# EAGLE design bilancia_smart_pezzi_ali (EAGLE 7.3.0)
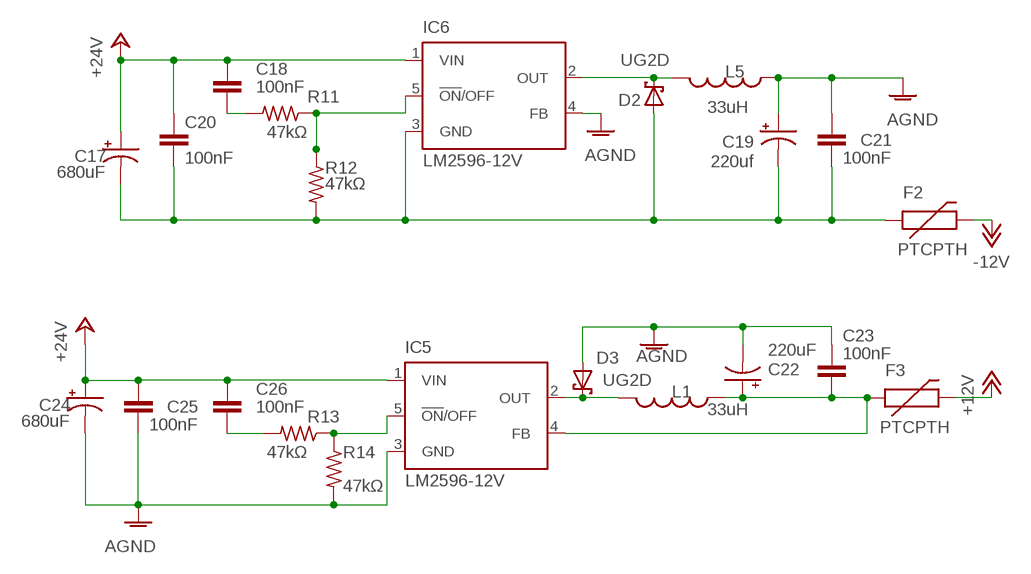
[diagram p0: schematic, sheet 1]

## Parts
C17  680uF  CPOL-USE5-8.5  [E5-8,5]
C18  100nF  C2.5/2  [C2.5-2]
C19  220uf  CPOL-USE5-8.5  [E5-8,5]
C20  100nF  C2.5/2  [C2.5-2]
C21  100nF  C2.5/2  [C2.5-2]
C22  220uF  CPOL-USE5-8.5  [E5-8,5]
C23  100nF  C2.5/2  [C2.5-2]
C24  680uF  CPOL-USE5-8.5  [E5-8,5]
C25  100nF  C2.5/2  [C2.5-2]
C26  100nF  C2.5/2  [C2.5-2]
D2  UG2D  SCHOTTKY-DIODEDO41-7  [DO41-7]
D3  UG2D  SCHOTTKY-DIODEDO41-7  [DO41-7]
F2  PTCPTH  [PTC]
F3  PTCPTH  [PTC]
IC5  LM2596-12V  LM2596T  [T05D]
IC6  LM2596-12V  LM2596T  [T05D]
L1  33uH  INDUCTORRLB0912  [RLB0912]
L5  33uH  INDUCTORRLB0912  [RLB0912]
R11  47kΩ  R-US_0207/2V  [0207/2V]
R12  47kΩ  R-US_0207/2V  [0207/2V]
R13  47kΩ  R-US_0207/2V  [0207/2V]
R14  47kΩ  R-US_0207/2V  [0207/2V]

## Nets
+12V [massa]: F3.P$2
+24V [massa]: C17.+ C18.1 C20.1 C24.+ C25.1 C26.1 IC5.1(VIN) IC6.1(VIN)
-12V [massa]: F2.P$2
AGND [massa]: C19.+ C21.1 C22.- C23.2 C24.- C25.2 D3.A IC5.3(GND) IC6.4(FB) L5.1 R14.2
N$14: IC6.5(!ON!/OFF) R11.1 R12.1
N$18: C18.2 R11.2
N$20 [massa]: D2.C IC6.2(OUT) L5.2
N$21 [massa]: C22.+ C23.1 F3.P$1 IC5.4(FB) L1.1
N$22 [massa]: C17.- C19.- C20.2 C21.2 D2.A F2.P$1 IC6.3(GND) R12.2
N$23 [massa]: D3.C IC5.2(OUT) L1.2
N$24: IC5.5(!ON!/OFF) R13.1 R14.1
N$25: C26.2 R13.2

## Library data of the parts
C17 C19 C22 C24 = resistor:CPOL-US: POLARIZED CAPACITOR, American symbol
C18 C20 C21 C23 C25 C26 = capacitor-wima:C: CAPACITOR naming: grid - package width
D2 D3 = adafruit:SCHOTTKY-DIODE: Schottky Diode
F2 F3 = SparkFun-PowerIC:PTC: Resettable Fuse PTC Resettable Fuse. Spark Fun Electronics SKU : COM-08357
IC5 IC6 = national-semiconductor:LM2596: SIMPLE SWITCHER® Power Converter 150 kHz 3A Step-Down Voltage Regulator Source: http://www.national.com/ds/LM/LM2596.pdf; MPN: LM2596T-ADJ/LF02; OC_FARNELL: 9494162; OC_NEWARK: 65K5910
L1 L5 = SparkFun-Passives:INDUCTOR: Inductors Basic Inductor/Choke - 0603 and 1206. Footprints are not proven and vary greatly between part numbers. SRN6045- 33uH, 20% 1.4A
R11-R14 = resistor:R-US_: RESISTOR, American symbol

## Net classes
0 default: clearance 0.205 mm
1 massa: width 0.5 mm, clearance 0.205 mm

## Board
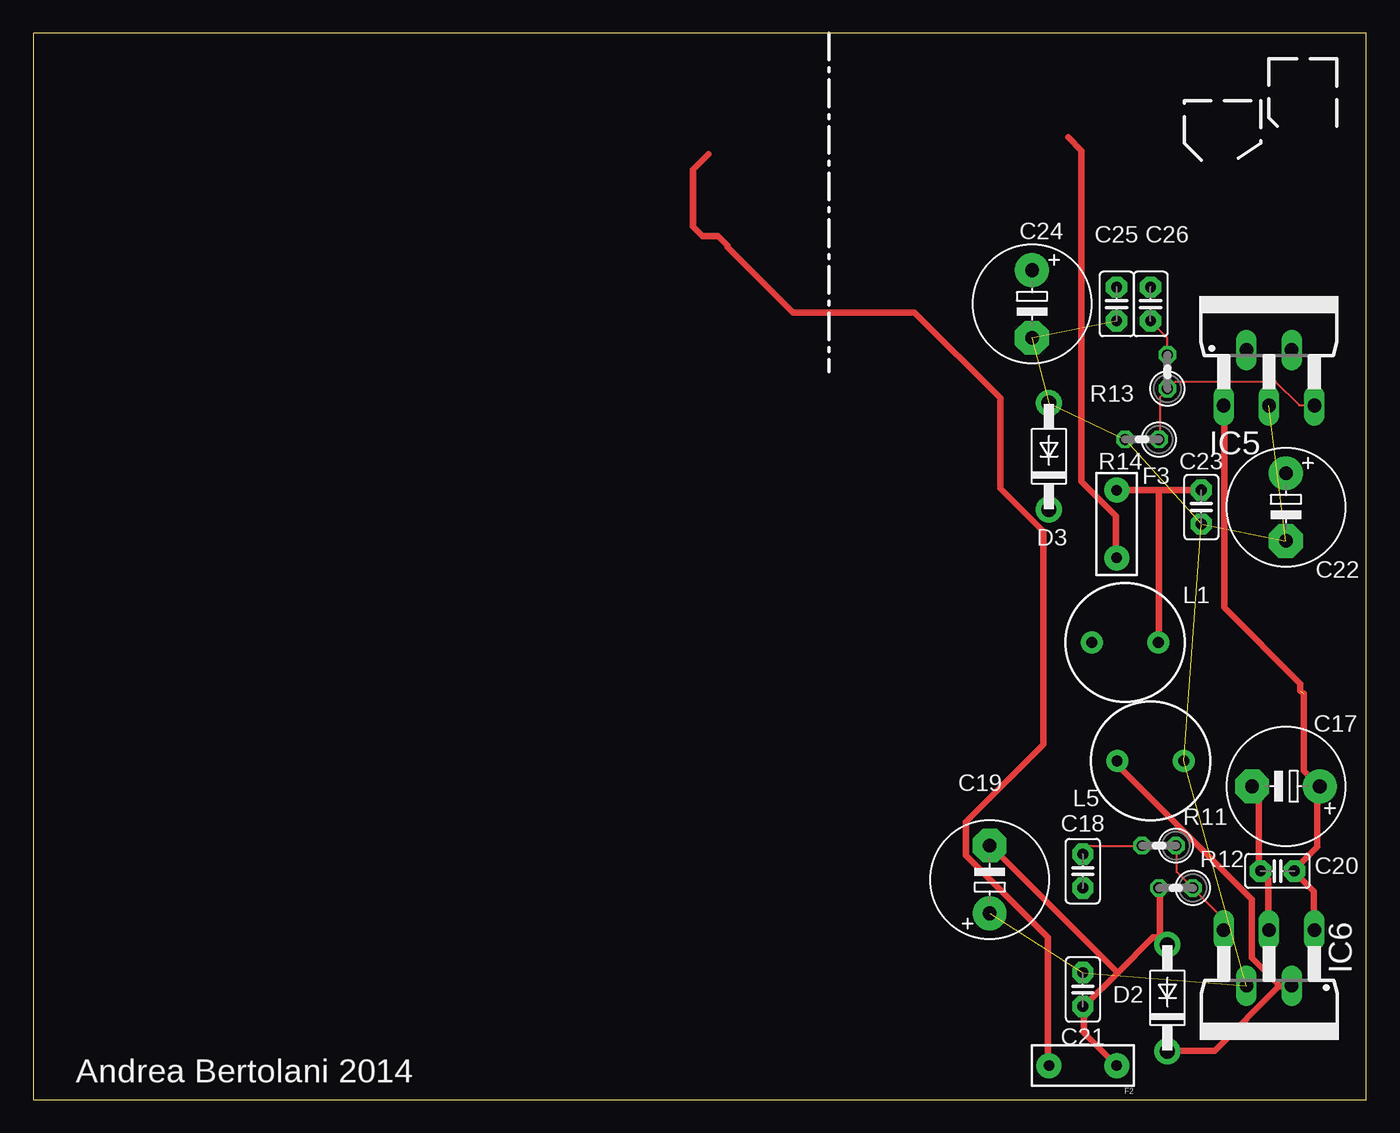
[diagram p1: board, top side]
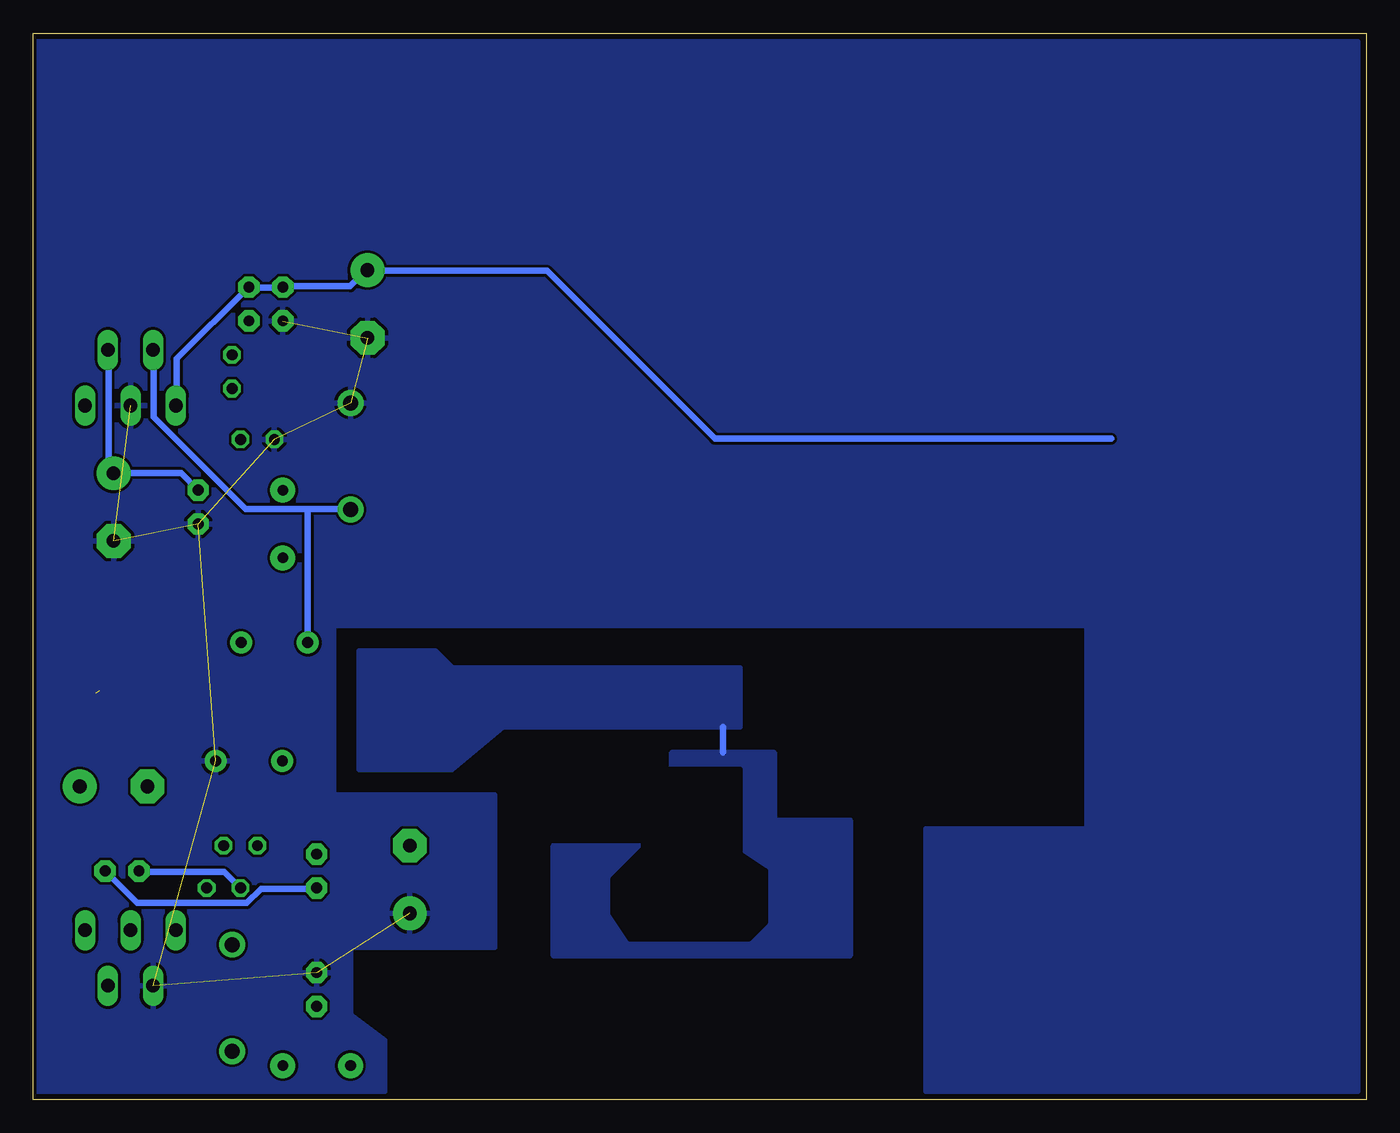
[diagram p2: board, bottom side, seen from below]

Size 100 x 80 mm. Coordinates in mm from the lower left corner, seen from the top.
Outline: 0,0 100,0 100,80 0,80 0,0
Copper layers (1*16): Top 0.035mm / dielectric 1.5mm / Bottom 0.035mm
Design rules "SeeedStudio_2layer_DRU_no_angle_20140221": minimum track width 6mil, minimum drill 12mil, track to track 6mil, track to pad 6mil, pad to pad 6mil, via to via 6mil, smd to smd 0mil, copper to edge 10mil, drill to drill 10mil, minimum pad ring 10mil, minimum via ring 6mil, stop-mask expansion 2mil, vias tented up to drill 100mil, thermal gap 10mil
tRestrict: area 45.1,12.1 to 56.5,24.8
bRestrict: area 45.1,12.1 to 56.5,24.8

### Footprints (pad centres in the part's own frame; a part is rotated, then mirrored left to right if it is on the bottom)
E5-8,5 = drill 1.016 pad 2.54: + -2.54,0 | drill 1.016 pad 2.54 octagon: - 2.54,0
C2.5-2 = drill 0.813 pad 1.6 octagon: 1 -1.27,0; 2 1.27,0
DO41-7 = drill 1.118 pad 1.93: A 4,0; C -4,0
PTC = drill 0.8 pad 1.88: P$1 -2.54,0; P$2 2.54,0
T05D = drill 1.016 long: 1 -3.404,-5.08; 2 -1.702,-0.914; 3 0,-5.08; 4 1.702,-0.914; 5 3.404,-5.08
RLB0912 = drill 0.813 pad 1.651: 1 2.502,0; 2 -2.502,0
0207/2V = drill 0.813 octagon: 1 -1.27,0; 2 1.27,0

### Placement (x,y rotation side)
C17  93.98,23.5 180 top
C18  78.74,17.14 90 top
C19  71.75,16.51 90 top
C20  93.34,17.14 180 top
C21  78.74,8.26 270 top
C22  93.98,44.45 270 top
C23  87.63,44.45 270 top
C24  74.93,59.69 270 top
C25  81.28,59.69 270 top
C26  83.82,59.69 270 top
D2  85.09,7.62 90 top
D3  76.2,48.26 90 top
F2  78.74,2.54 180 top
F3  81.28,43.18 270 top
IC5  92.71,57.15 0 top
IC6  92.71,7.62 180 top
L1  81.92,34.29 0 top
L5  83.82,25.4 0 top
R11  84.45,19.05 180 top
R12  85.72,15.88 180 top
R13  85.09,54.61 90 top
R14  83.19,49.53 180 top

### Tracks (layer width: path | path; a pad name or v marks a point on that pad's centre or on a via)
+12V
  Top 0.5: 77.64,72.19 78.63,71.21 78.63,46.37 81.22,43.78 81.22,40.65 F3.P$2
+24V  (1 unrouted)
  Top 0.5: 95.34,30.47 95.34,24.66 96.5,23.5 C17.+ 96.32,23.32 96.32,18.94 94.71,17.33 C20.1 94.62,17.07 96.05,15.64 96.05,12.78 IC6.1 | 95.07,30.65 95.07,31.18 89.35,36.9 89.35,52 IC5.1
  Bottom 0.5: C18.1 78.81,15.81 82.92,15.81 83.99,14.74 92.21,14.74 94.53,17.07 C20.1 | IC5.1 89.26,52.09 89.26,55.58 83.9,60.94 C26.1 83.63,60.94 81.31,60.94 C25.1 81.04,61.03 76.22,61.03 75.14,62.1 C24.+ 74.88,62.19 61.47,62.19 48.87,49.59 19.12,49.59
-12V
  Top 0.5: 50.66,70.94 49.5,69.78 49.5,65.49 50.22,64.78 51.38,64.78 52.09,64.06 52.09,63.98 57.01,59.06 66.12,59.06 72.55,52.63 72.55,45.84 75.77,42.62 75.77,26.63 69.96,20.82 69.96,18.32 76.13,12.15 76.13,2.59 F2.P$2
AGND  (10 unrouted)
  pour Bottom: 0.64,0.64 0.64,79.38 99.69,79.38 99.69,0.64 73.66,0.64 73.66,4.45 76.2,6.35 76.2,11.43 65.41,11.43 65.41,22.86 77.47,22.86 77.47,35.56 20.95,35.56 20.95,20.32 33.02,20.32 33.02,0.64
GND
  Bottom 0.5: 48.25,27.94 48.25,26.04
  pour Bottom: 44.45,26.04 44.45,20.95 38.73,20.95 38.73,10.79 60.96,10.79 60.96,19.05 53.98,19.05 52.07,20.95 52.07,26.04
  pour Bottom: 75.56,33.66 75.56,24.77 68.58,24.77 64.77,27.94 46.99,27.94 46.99,32.38 68.58,32.38 69.85,33.66
N$14
  Top 0.152: 87.03,15.9 R12.1 | R11.1 85.78,19.03 85.78,17.07 86.94,15.9 R12.1 | IC6.5 89.26,12.78 89.26,13.58 87.03,15.81 R12.1
N$18
  Top 0.152: R11.2 83.19,19.03 79.34,19.03 78.81,18.5 C18.2
N$20
  Top 0.5: 93.46,8.49 94.35,8.49 IC6.2 | 93.46,8.49 88.64,3.66 85.15,3.66 D2.C | L5.2 81.4,25.38 81.4,25.02 91.41,15.01 91.41,10.63 93.37,8.67 93.46,8.49
N$21
  Top 0.5: 84.44,45.75 81.31,45.75 F3.P$1 | 84.44,45.75 87.56,45.75 C23.1 | 84.44,45.75 84.44,34.31 L1.1
  Bottom 0.5: IC5.4 94.35,56.2 94.35,47.35 94,47 C22.+ 93.73,47 88.9,47 87.65,45.75 C23.1
N$22
  Top 0.5: IC6.3 92.66,12.78 92.66,16.53 92.12,17.07 C20.2 91.94,17.33 91.94,22.96 91.49,23.41 C17.- | R12.2 84.53,15.81 84.53,12.24 85.06,11.71 D2.A 84.35,12.15 83.99,12.15 81.35,9.52 | F2.P$1 81.22,2.59 78.81,5 78.81,6.97 C21.2 78.98,7.15 81.35,9.52 | 81.35,9.52 71.84,19.03 C19.-
  Bottom 0.5: C20.2 92.03,17.07 85.69,17.07 84.53,15.9 R12.2
N$23
  Bottom 0.5: 79.43,44.32 76.22,44.32 D3.C | 79.43,44.32 84.08,44.32 90.96,51.2 90.96,56.2 IC5.2 | 79.43,44.32 79.43,34.31 L1.2
N$24
  Top 0.152: 84.44,49.59 R14.1 84.53,49.59 84.53,52.72 85.06,53.25 R13.1 85.15,53.34 85.69,53.88 93.19,53.88 94.98,52.09 96.05,52.09 IC5.5
N$25
  Top 0.152: R13.2 85.06,55.93 85.06,57.18 83.9,58.35 C26.2

### Text on the board
tPlace: Andrea Bertolani 2014